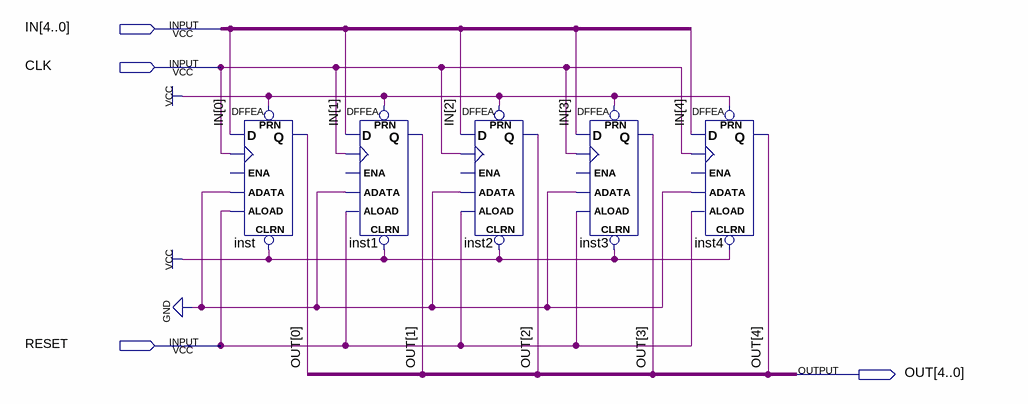
[diagram p0: schematic sheet]
// Quartus schematic REGISTER.bdf as structural Verilog: 5 symbols, 4 pins
module REGISTER (
  input  [4:0] IN,
  input  CLK,
  input  RESET,
  output [4:0] OUT
);

  DFFEA inst (.PRN(1'b1), .ALOAD(RESET), .ADATA(1'b0), .CLK(CLK), .D(IN[0]), .CLRN(1'b1), .Q(OUT[0]));  // open: ENA
  DFFEA inst1 (.PRN(1'b1), .ALOAD(RESET), .ADATA(1'b0), .CLK(CLK), .D(IN[1]), .CLRN(1'b1), .Q(OUT[1]));  // open: ENA
  DFFEA inst2 (.PRN(1'b1), .ALOAD(RESET), .ADATA(1'b0), .CLK(CLK), .D(IN[2]), .CLRN(1'b1), .Q(OUT[2]));  // open: ENA
  DFFEA inst3 (.PRN(1'b1), .ALOAD(RESET), .ADATA(1'b0), .CLK(CLK), .D(IN[3]), .CLRN(1'b1), .Q(OUT[3]));  // open: ENA
  DFFEA inst4 (.PRN(1'b1), .ALOAD(RESET), .ADATA(1'b0), .CLK(CLK), .D(IN[4]), .CLRN(1'b1), .Q(OUT[4]));  // open: ENA
endmodule
